# EAGLE design +5, -5, +9, -9 (EAGLE 9.6.2)
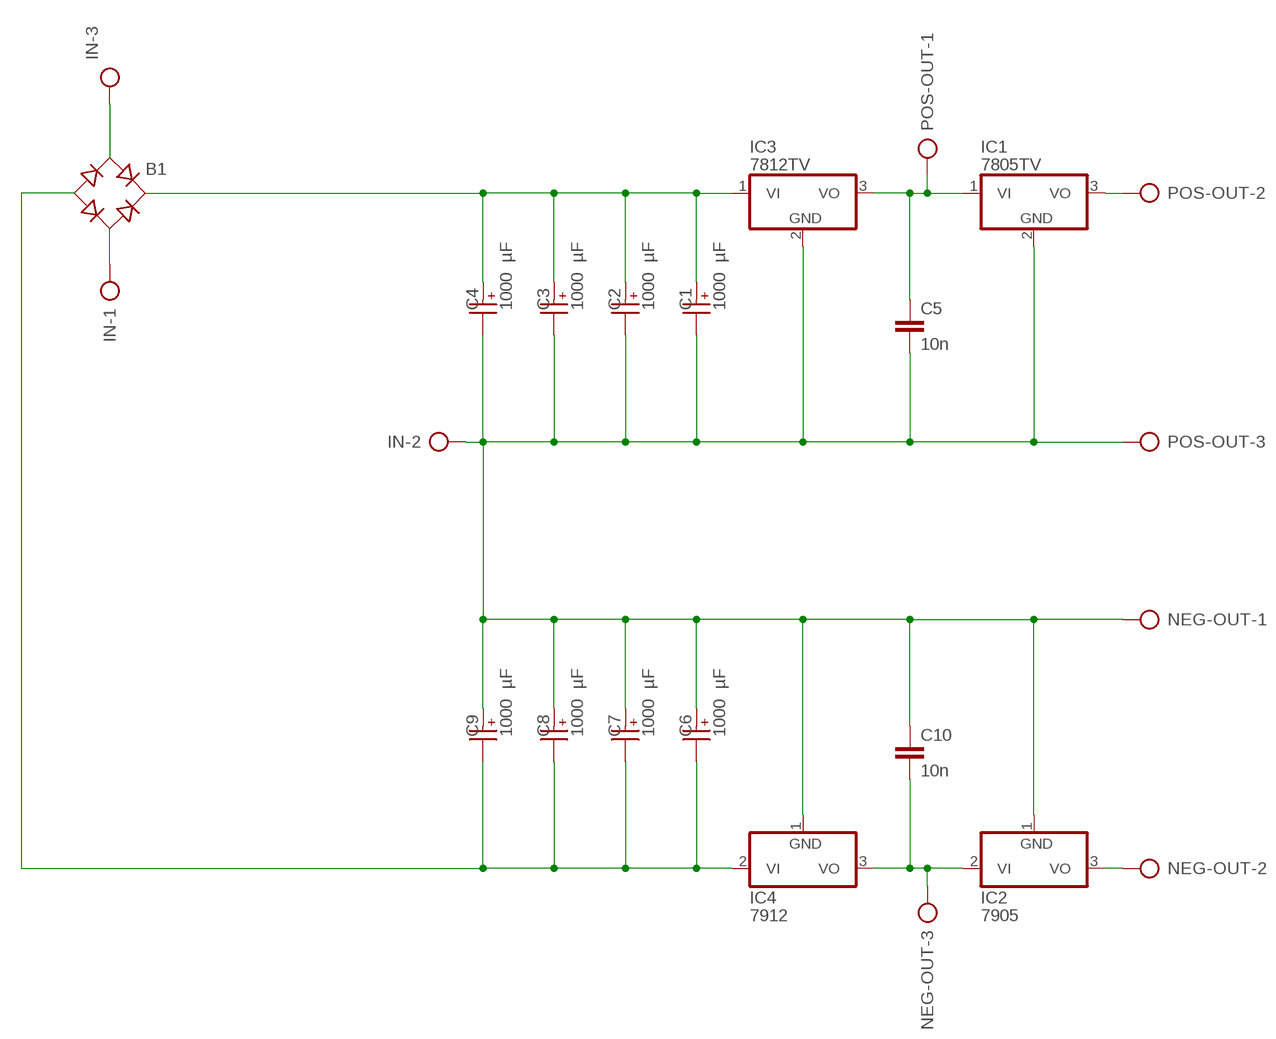
[diagram p0: schematic, sheet 1]

## Parts
B1  RB1A  [RB1A]
C1  1000 µF  WCAP-ATG8_10X12.5_860010275016  [WCAP-ATG8_10X12.5(DXL)]
C2  1000 µF  WCAP-ATG8_10X12.5_860010275016  [WCAP-ATG8_10X12.5(DXL)]
C3  1000 µF  WCAP-ATG8_10X12.5_860010275016  [WCAP-ATG8_10X12.5(DXL)]
C4  1000 µF  WCAP-ATG8_10X12.5_860010275016  [WCAP-ATG8_10X12.5(DXL)]
C5  10n  C-EU025-025X050  [C025-025X050]
C6  1000 µF  WCAP-ATG8_10X12.5_860010275016  [WCAP-ATG8_10X12.5(DXL)]
C7  1000 µF  WCAP-ATG8_10X12.5_860010275016  [WCAP-ATG8_10X12.5(DXL)]
C8  1000 µF  WCAP-ATG8_10X12.5_860010275016  [WCAP-ATG8_10X12.5(DXL)]
C9  1000 µF  WCAP-ATG8_10X12.5_860010275016  [WCAP-ATG8_10X12.5(DXL)]
C10  10n  C-EU025-025X050  [C025-025X050]
IC1  7805TV  [TO220V]
IC2  7905  7905T  [TO220H]
IC3  7812TV  [TO220V]
IC4  7912  7912T  [TO220H]
IN  AK300/3  [AK300/3]
NEG-OUT  AK300/3  [AK300/3]
POS-OUT  AK300/3  [AK300/3]

## Nets
GND: C1.2(-) C2.2(-) C3.2(-) C4.2(-) C5.2 C6.1(+) C7.1(+) C8.1(+) C9.1(+) C10.1 IC1.2(GND) IC2.1(GND) IC3.2(GND) IC4.1(GND) IN.2 NEG-OUT.1 POS-OUT.3
N$1: B1.AC1 IN.3
N$3: B1.AC2 IN.1
N$4: B1.+ C1.1(+) C2.1(+) C3.1(+) C4.1(+) IC3.1(VI)
N$5: IC2.3(VO) NEG-OUT.2
N$6: IC1.3(VO) POS-OUT.2
N$7: B1.- C6.2(-) C7.2(-) C8.2(-) C9.2(-) IC4.2(VI)
N$9: C5.1 IC1.1(VI) IC3.3(VO) POS-OUT.1
N$10: C10.2 IC2.2(VI) IC4.3(VO) NEG-OUT.3

## Library data of the parts
B1 = rectifier:RB1A: RECTIFIER 1 A
C1-C4 C6-C9 = Aluminium Electrolyt Capacitors:WCAP-ATG8_10X12.5: WCAP-ATG8 Aluminium Electrolytic Capacitors General Purpose +85 °C Characteristics General purpose product series with max. operating temperature of +85 °C Wide range of capacitance value Mounting style: THT Radial Capacitance range: 0.1 µF ‒ 33000 µF Capacitance tolerance: ±20 % Voltage range (UR): 10 ‒ 400 V(DC) Operating temperature: -40 °C up to +85 °C for UR < 400 V(DC) -25 °C up to +85 °C for UR ≥ 400 V(DC) Endurance: 2000 h @ +85 °C Dimensions (DxL) in mm: 5.0 x 11.0 up to 22.0 x 51.0 Recommended soldering: Wave soldering Applications Filtering Smoothing Energy storage Coupling <https://www.we-online.com/catalog/media/o35732v209%20WCAP-ATG8_4C.jpg> Details see: https://www.we-online.com/catalog/en/WCAP-ATG8/ Updated by yingchun,Shan;2020-02-27 2020(C) Würth Elektronik; DATASHEET-URL: https://www.we-online.com/catalog/datasheet/860010275016.pdf; DF: 19%; DIAMETER: 10mm; I-LEAK: 100uA; I-RIPPLE: 726mA; L: 12.5mm; OPERATING-TEMPERATURE: -40 °C up to +85 °C; PART-NUMBER: 860010275016; PITCH: 5mm; TECHNICAL-REFERENCE: ATBF125102M010DSPA9B000; VR: 10V(DC)
C5 C10 = rcl:C-EU: CAPACITOR, European symbol; SPICEPREFIX: C
IC1 IC3 = linear:78*: Positive VOLTAGE REGULATOR Source: http://cache.national.com/ds/LM/LM78L05.pdf http://www.fairchildsemi.com/ds/LM/LM7805.pdf
IC2 IC4 = linear:79*: Negative VOLTAGE REGULATOR
IN NEG-OUT POS-OUT = con-ptr500:AK300/3: CONNECTOR; OC_FARNELL: unknown; OC_NEWARK: unknown

## Board
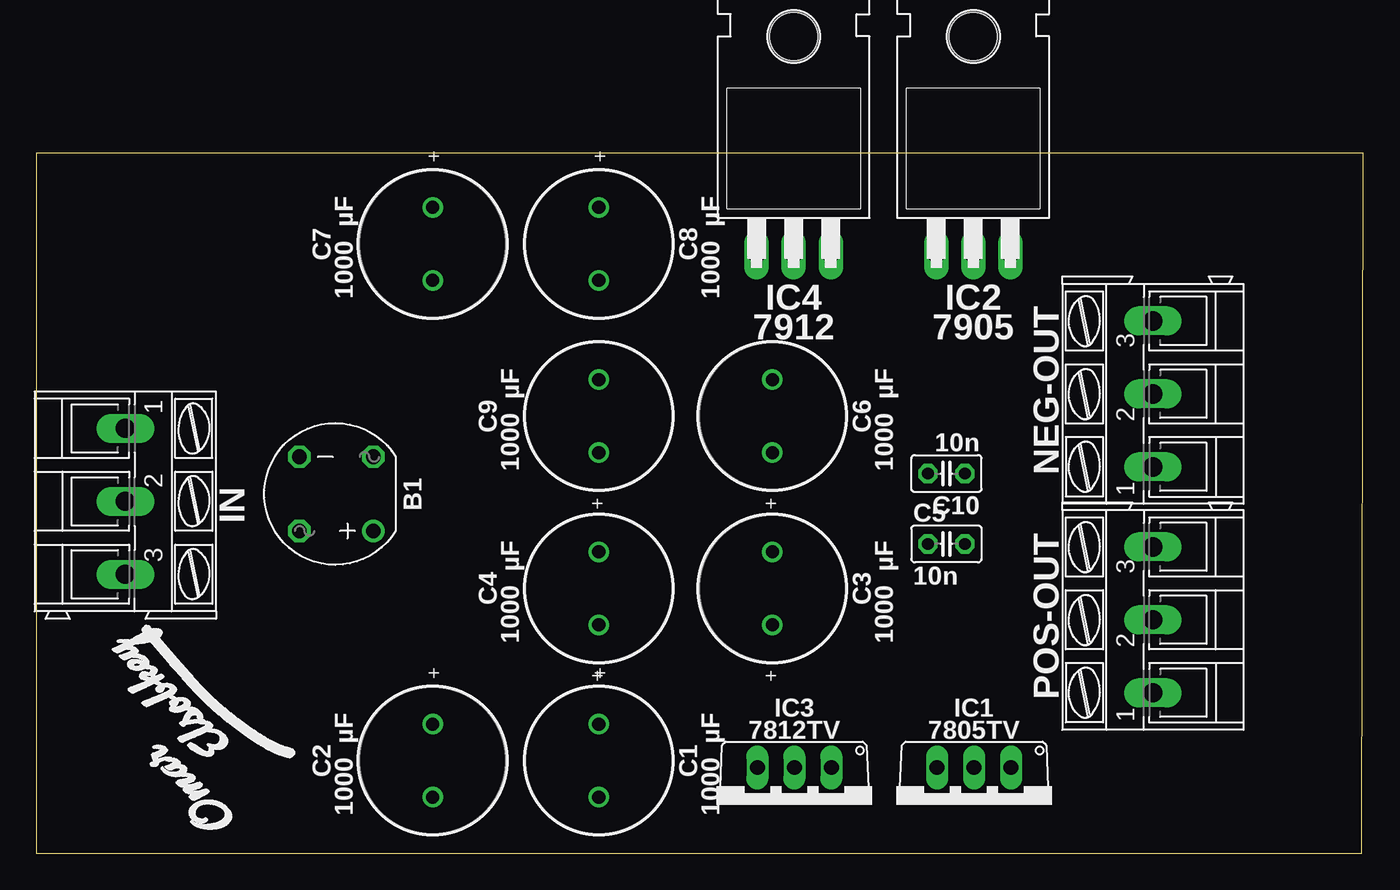
[diagram p1: board, top side]
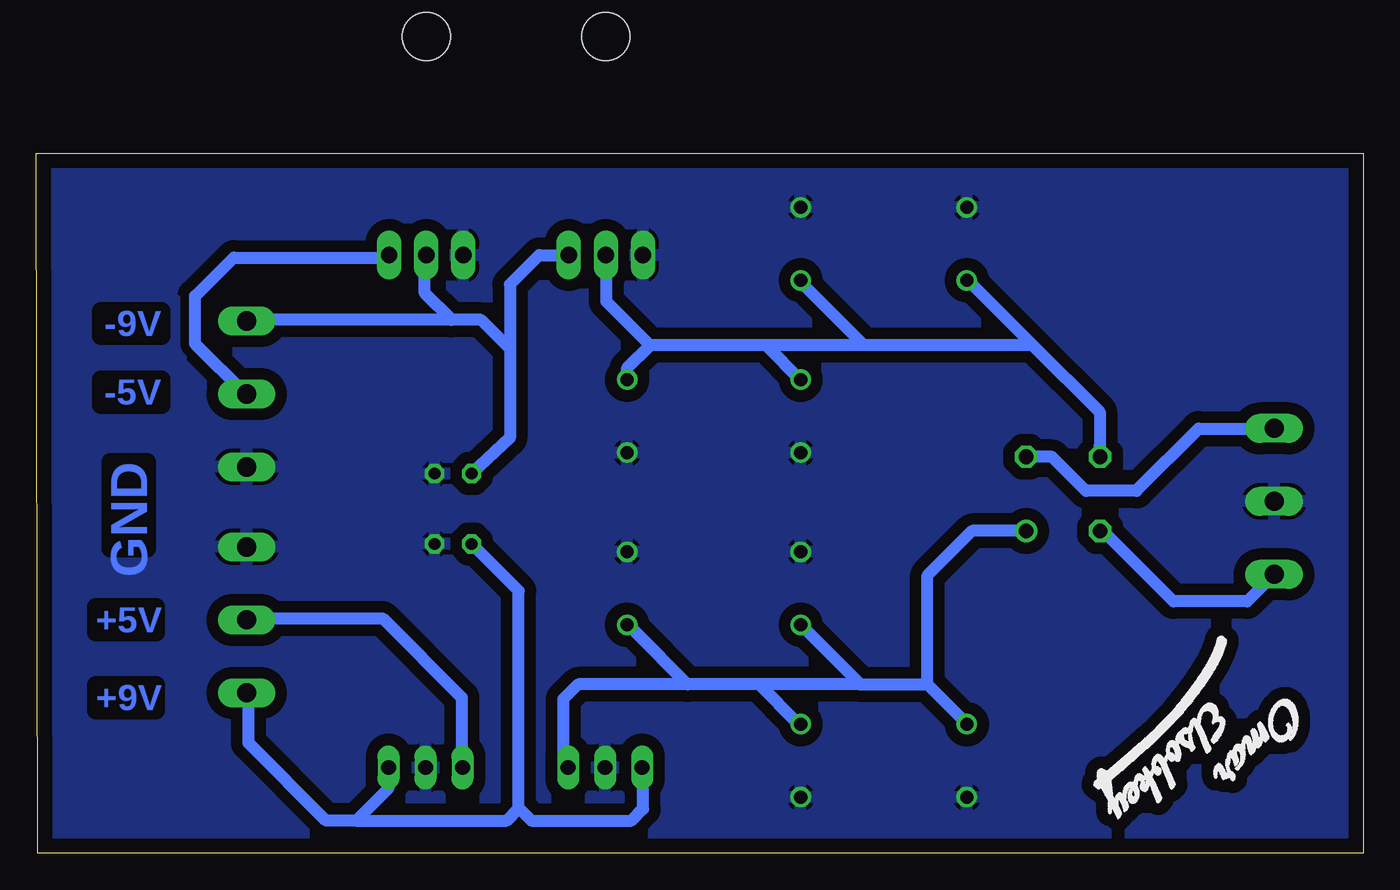
[diagram p2: board, bottom side, seen from below]

Size 91 x 48 mm. Coordinates in mm from the lower left corner, seen from the top.
Outline: 90.91,0 91,48 0,48 0,0 90.91,0
Copper layers (1*16): Top 0.035mm / dielectric 1.5mm / Bottom 0.035mm
Design rules "default *": minimum track width 0.8mm, minimum drill 0.7mm, track to track 0.6mm, track to pad 0.6mm, pad to pad 0.6mm, via to via 0.6mm, smd to smd 0.6mm, copper to edge 40mil, drill to drill 6mil, minimum pad ring 10mil, minimum via ring 8mil, stop-mask expansion 4mil, vias tented up to drill 0mil, thermal gap 10mil

### Footprints (pad centres in the part's own frame; a part is rotated, then mirrored left to right if it is on the bottom)
RB1A = drill 1.016: + -2.54,2.54 | drill 1.016 octagon: - 2.54,-2.54; AC1 2.54,2.54; AC2 -2.54,-2.54
WCAP-ATG8_10X12.5(DXL) = drill 0.9: 1 2.5,0; 2 -2.5,0
C025-025X050 = drill 0.813 octagon: 1 -1.27,0; 2 1.27,0
TO220V = drill 1.016 long: 1 -2.54,-2.54; 2 0,-2.54; 3 2.54,-2.54
TO220H = drill 1.118 long: 1 -2.54,-10.16; 2 0,-10.16; 3 2.54,-10.16 | hole 3.302: 0,4.826
AK300/3 = drill 1.321 long: 1 -5.004,0; 2 0,0; 3 5.004,0

### Placement (x,y rotation side)
B1  20.57,24.64 180 top
C1  38.58,6.35 90 top
C2  27.18,6.35 90 top
C3  50.48,18.16 270 top
C4  38.58,18.16 270 top
C5  62.42,21.21 0 top
C6  50.48,29.97 270 top
C7  27.18,41.78 90 top
C8  38.58,41.78 90 top
C9  38.58,29.97 270 top
C10  62.42,26.04 180 top
IC1  64.31,3.33 180 top
IC2  64.26,51.18 0 top
IC3  51.99,3.33 180 top
IC4  51.94,51.18 0 top
IN  6.1,24.13 270 top
NEG-OUT  76.58,31.5 90 top
POS-OUT  76.58,16 90 top
U$1  [OMAR_ELSOBKEY_X1_T]  11.01,7.53 225 bottom
U$2  [OMAR_ELSOBKEY_X1_TN]  11.01,7.53 225 bottom
U$4  [OMAR_ELSOBKEY_X1_TN]  10.36,8.18 135 top

### Tracks (layer width: path | path; a pad name or v marks a point on that pad's centre or on a via)
GND
  pour Bottom (isolate 0.8): -6.86,55.12 97.79,55.12 97.79,-6.35 -6.86,-6.35
N$1
  Bottom 0.813: IN.3 7.95,17.27 13.01,17.27 17.68,21.95 B1.AC1
N$3
  Bottom 0.813: IN.1 6.12,29.11 11.28,29.11 15.54,24.84 19,24.84 21.34,27.18 B1.AC2
N$4
  Bottom 0.813: 29.87,11.58 27.43,9.14 C2.1 | 34.49,11.58 29.87,11.58 | C4.1 34.49,11.58 | 46.33,11.58 49.99,15.24 C3.1 | 41.45,11.58 46.33,11.58 | 41.45,11.58 38.83,8.96 38.69,8.96 C1.1 | B1.+ 26.82,22.1 29.87,19.05 29.87,11.58 | 46.33,11.58 53.85,11.58 54.86,10.57 54.86,6.1 IC3.1 | 34.49,11.58 41.45,11.58
N$5
  Bottom 0.813: NEG-OUT.2 76.66,31.5 80.11,34.95 80.11,38.2 77.47,40.84 67.06,40.84 IC2.3
N$6
  Bottom 0.813: IC1.3 61.82,5.92 61.82,10.67 67.26,16.1 76.73,16.1 76.63,16 POS-OUT.2
N$7
  Bottom 0.813: 50.66,32.47 C6.2 50.48,33.29 48.92,34.85 | IC4.2 51.92,41 51.92,37.85 48.92,34.85 | 22.66,34.85 26.82,39.01 C7.2 | B1.- 18.03,27.94 18.07,27.97 18.07,30.26 22.66,34.85 | 22.66,34.85 34.24,34.85 | 38.56,32.51 C9.2 40.89,34.79 40.89,34.85 | 34.24,34.85 38.41,39.01 C8.2 | 34.24,34.85 40.89,34.85 | 40.89,34.85 48.92,34.85
N$9
  Bottom 0.813: C5.1 61.14,21.21 57.91,17.98 57.91,3.05 | 57.91,3.05 58.73,2.23 69.09,2.23 | 57.91,3.05 57.89,3.07 57.05,2.23 50.19,2.23 49.38,3.05 49.38,5.49 IC3.3 | 66.9,5.16 66.85,5.21 IC1.1 66.85,4.47 69.09,2.23 | 69.09,2.23 71.12,2.23 76.45,7.57 76.45,10.99 POS-OUT.1
N$10
  Bottom 0.813: 58.52,34.59 58.52,28.49 C10.2 | IC4.3 56.52,41.02 58.52,39.01 58.52,34.59 | 62.53,36.58 64.36,38.41 64.36,40.97 IC2.2 | 62.53,36.58 60.5,36.58 58.52,34.59 | 62.53,36.58 76.5,36.58 NEG-OUT.3
NAMES
  pour Bottom (isolate 0.508): 80.77,37.34 80.77,9.65 arc90 81.79,8.64 87.12,8.64 arc90 88.14,9.65 88.14,37.59 arc90 87.38,38.35 81.79,38.35 arc90

### Text on the board
Bottom: -9V | -5V | GND | +5V | +9V